# EAGLE design BTModule (EAGLE 9.5.0)
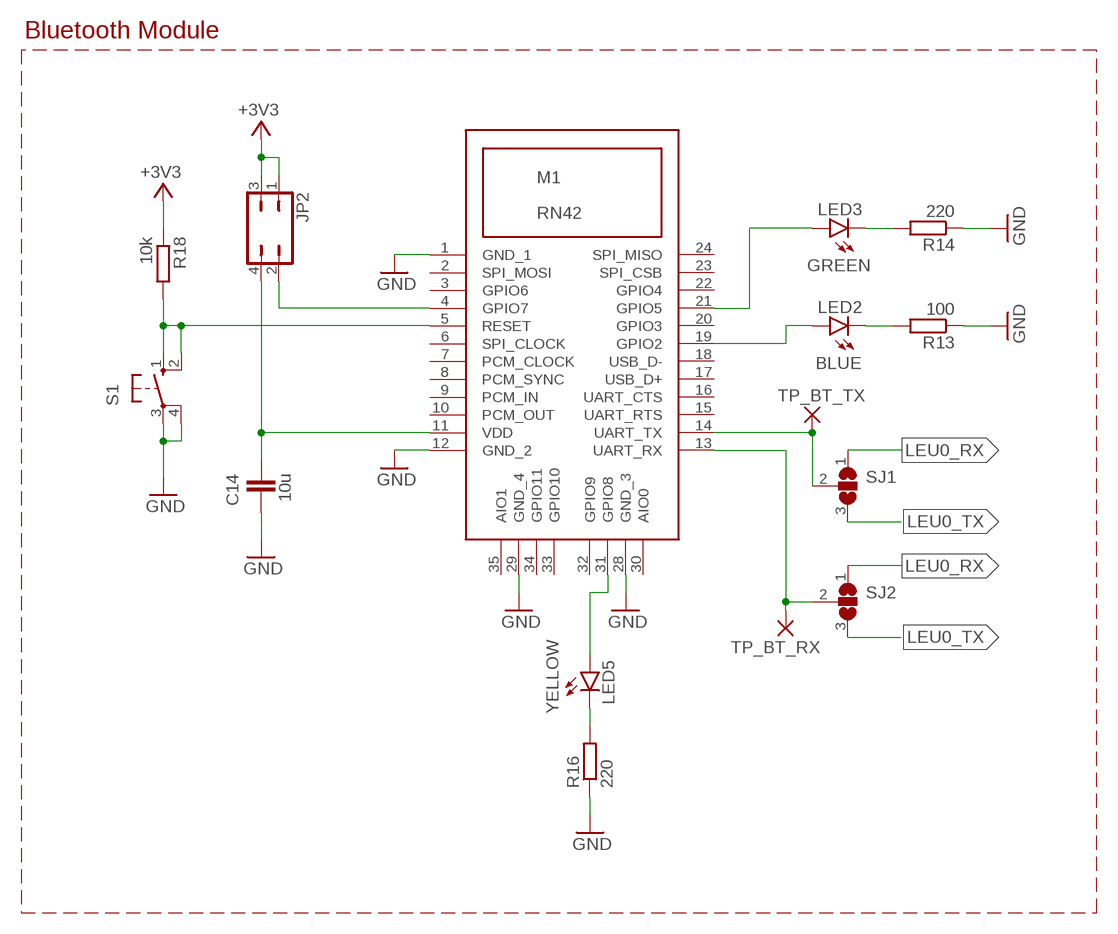
[diagram p0: schematic, sheet 1]

## Parts
C14  10u  C-EUC0805K  [C0805K]
JP2  JP2Q  [JP2Q]
LED2  BLUE  LEDCHIP-LED0805  [CHIP-LED0805]
LED3  GREEN  LEDCHIP-LED0805  [CHIP-LED0805]
LED5  YELLOW  LEDCHIP-LED0805  [CHIP-LED0805]
M1  RN42_BLUETOOTH  [RN42_BLUETOOTH]
R13  100  R-EU_R0805  [R0805]
R14  220  R-EU_R0805  [R0805]
R16  220  R-EU_R0805  [R0805]
R18  10k  R-EU_R0805  [R0805]
S1  10-XX  [B3F-10XX]
SJ1  SJ2W  [SJ_2]
SJ2  SJ2W  [SJ_2]
TP_BT_RX  TESTPOINT  [3,2/1,6]
TP_BT_TX  TESTPOINT  [3,2/1,6]

## Nets
+3V3: JP2.1 JP2.3 R18.1
GND: C14.1 M1.1(GND_1) M1.12(GND_2) M1.28(GND_3) M1.29(GND_4) R13.1 R14.1 R16.1 S1.3(P) S1.4(P1)
LEU0_RX: SJ1.1 SJ2.1
LEU0_TX: SJ1.3 SJ2.3
N$9: JP2.2 M1.4(GPIO7)
N$12: C14.2 JP2.4 M1.11(VDD)
N$15: LED2.C R13.2
N$16: LED2.A M1.19(GPIO2)
N$17: LED3.C R14.2
N$18: LED3.A M1.21(GPIO5)
N$19: LED5.C R16.2
N$20: LED5.A M1.31(GPIO8)
N$21: M1.5(RESET) R18.2 S1.1(S) S1.2(S1)
N$31: M1.14(UART_TX) SJ1.2 TP_BT_TX.1(P)
N$32: M1.13(UART_RX) SJ2.2 TP_BT_RX.1(P)
Unconnected: M1.2(SPI_MOSI) M1.3(GPIO6) M1.6(SPI_CLOCK) M1.7(PCM_CLOCK) M1.8(PCM_SYNC) M1.9(PCM_IN) M1.10(PCM_OUT) M1.15(UART_RTS) M1.16(UART_CTS) M1.17(USB_D+) M1.18(USB_D-) M1.20(GPIO3) M1.22(GPIO4) M1.23(SPI_CSB) M1.24(SPI_MISO) M1.30(AIO0) M1.32(GPIO9) M1.33(GPIO10) M1.34(GPIO11) M1.35(AIO1)

## Notes on the sheet
- Bluetooth Module

## Library data of the parts
C14 = rcl:C-EU: CAPACITOR, European symbol; SPICEPREFIX: C
JP2 = jumper:JP2Q: JUMPER
LED2 LED3 LED5 = led:LED: LED OSRAM: - CHIPLED LG R971, LG N971, LY N971, LG Q971, LY Q971, LO R971, LY R971 LH N974, LH R974 LS Q976, LO Q976, LY Q976 LO Q996 - Hyper CHIPLED LW Q18S LB Q993, LB Q99A, LB R99A - SideLED LS A670, LO A670, LY A670, LG A670, LP A670 LB A673, LV A673, LT A673, LW A673 LH A674 LY A675 LS A676, LA A676, LO A676, LY A676, LW A676 LS A679, LY A679, LG A679 - Hyper Micro SIDELED® LS Y876, LA Y876, LO Y876, LY Y876 LT Y87S - SmartLED LW L88C, LW L88S LB L89C, LB L89S, LG L890 LS L89K, LO L89K, LY L89K LS L896, LA L896, LO L896, LY L896 - TOPLED LS T670, LO T670, LY T670, LG T670, LP T670 LSG T670, LSP T670, LSY T670, LOP T670, LYG T670 LG T671, LOG T671, LSG T671 LB T673, LV T673, LT T673, LW T673 LH T674 LS T676, LA T676, LO T676, LY T676, LB T676, LH T676, LSB T676, LW T676 LB T67C, LV T67C, LT T67C, LS T67K, LO T67K, LY T67K, LW E67C LS E67B, LA E67B, LO E67B, LY E67B, LB E67C, LV E67C, LT E67C LW T67C LS T679, LY T679, LG T679 LS T770, LO T770, LY T770, LG T770, LP T770 LB T773, LV T773, LT T773, LW T773 LH T774 LS E675, LA E675, LY E675, LS T675 LS T776, LA T776, LO T776, LY T776, LB T776 LHGB T686 LT T68C, LB T68C - Hyper Mini TOPLED® LB M676 - Mini TOPLED Santana® LG M470 LS M47K, LO M47K, LY M47K Source: http://www.osram.convergy.de LUXEON: - LUMILED® LXK2-PW12-R00, LXK2-PW12-S00, LXK2-PW14-U00, LXK2-PW14-V00 LXK2-PM12-R00, LXK2-PM12-S00, LXK2-PM14-U00 LXK2-PE12-Q00, LXK2-PE12-R00, LXK2-PE12-S00, LXK2-PE14-T00, LXK2-PE14-U00 LXK2-PB12-K00, LXK2-PB12-L00, LXK2-PB12-M00, LXK2-PB14-N00, LXK2-PB14-P00, LXK2-PB14-Q00 LXK2-PR12-L00, LXK2-PR12-M00, LXK2-PR14-Q00, LXK2-PR14-R00 LXK2-PD12-Q00, LXK2-PD12-R00, LXK2-PD12-S00 LXK2-PH12-R00, LXK2-PH12-S00 LXK2-PL12-P00, LXK2-PL12-Q00, LXK2-PL12-R00 Source: www.luxeon.com KINGBRIGHT: KA-3528ASYC Source: www.kingbright.com; SPICEPREFIX: L
M1 = Moodlight:RN42_BLUETOOTH: RN42 Bluetooth module
R13 R14 R16 R18 = rcl:R-EU_: RESISTOR, European symbol; SPICEPREFIX: R
S1 = switch-omron:10-XX: OMRON SWITCH; MPN: B3F-1000; OC_FARNELL: 176432; OC_NEWARK: 36M3542
SJ1 SJ2 = jumper:SJ2W: SMD solder JUMPER
TP_BT_RX TP_BT_TX = Moodlight:TESTPOINT: Testpoint Drill: 1.6mm (dia) Pad: 3.2mm (dia)

## Board
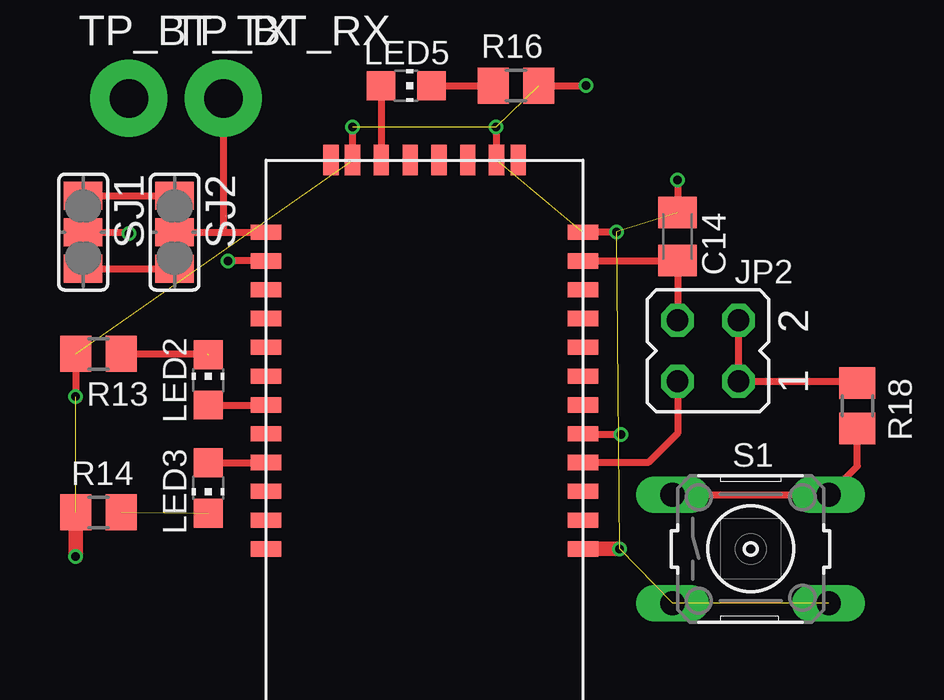
[diagram p1: board, top side]
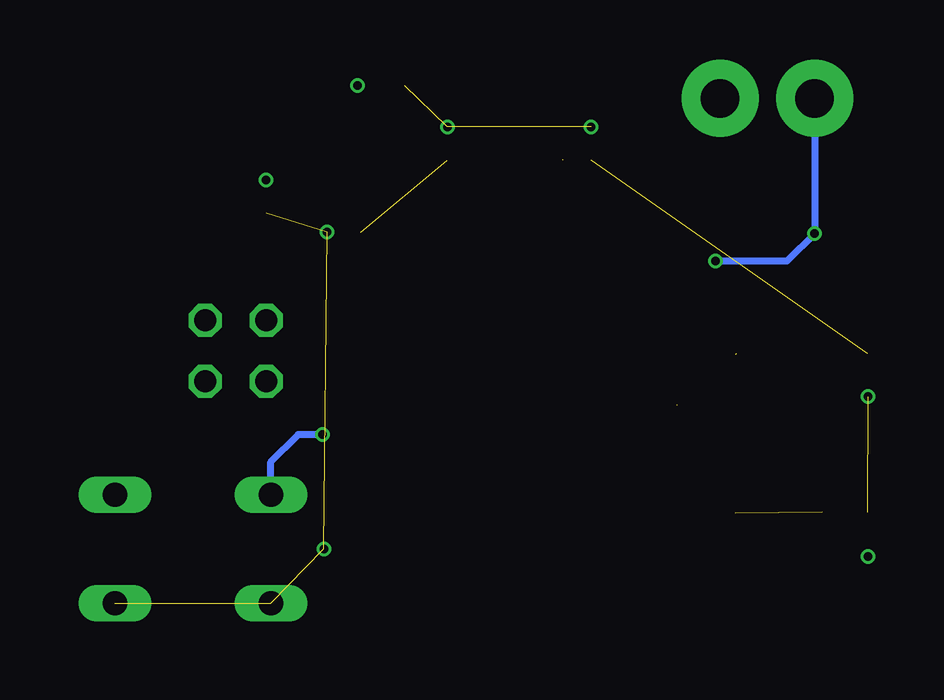
[diagram p2: board, bottom side, seen from below]

No outline drawn. Coordinates in mm, seen from the top.
Copper layers (1*16): Top 0.018mm / dielectric 1.55mm / Bottom 0.018mm
Design rules "default": minimum track width 0.15mm, minimum drill 0.35mm, track to track 0.15mm, track to pad 0.15mm, pad to pad 0.15mm, via to via 0.15mm, smd to smd 0mil, copper to edge 0.25mm, drill to drill 0.35mm, minimum pad ring 0.175mm, minimum via ring 0.125mm, stop-mask expansion 0mil, vias tented up to drill 0.45mm, thermal gap 0.2mm

### Footprints (pad centres in the part's own frame; a part is rotated, then mirrored left to right if it is on the bottom)
C0805K = smd 1.3 x 1.6: 1 -1,0; 2 1,0
JP2Q = drill 0.914 octagon: 1 -1.27,-1.27; 2 -1.27,1.27; 3 1.27,-1.27; 4 1.27,1.27
CHIP-LED0805 = smd 1.2 x 1.2: A 0,-1.05; C 0,1.05
RN42_BLUETOOTH = smd 1.27 x 0.635: 1 -6.6,0; 2 -6.6,-1.2; 3 -6.6,-2.4; 4 -6.6,-3.6; 5 -6.6,-4.8; 6 -6.6,-6; 7 -6.6,-7.2; 8 -6.6,-8.4; 9 -6.6,-9.6; 10 -6.6,-10.8; 11 -6.6,-12; 12 -6.6,-13.2; 13 6.6,-13.2; 14 6.6,-12; 15 6.6,-10.8; 16 6.6,-9.6; 17 6.6,-8.4; 18 6.6,-7.2; 19 6.6,-6; 20 6.6,-4.8; 21 6.6,-3.6; 22 6.6,-2.4; 23 6.6,-1.2; 24 6.6,0 | smd 0.635 x 1.27: 28 3,-16.2; 29 -3,-16.2; 30 3.9,-16.2; 31 1.8,-16.2; 32 0.6,-16.2; 33 -0.6,-16.2; 34 -1.8,-16.2; 35 -3.9,-16.2
R0805 = smd 1.3 x 1.5: 1 -0.95,0; 2 0.95,0
B3F-10XX = drill 1.016 long: 1 -3.251,2.261; 2 3.251,2.261; 3 -3.251,-2.261; 4 3.251,-2.261
SJ_2 = smd 1.168 x 1.6: 1 -1.524,0; 2 0,0; 3 1.524,0
3,2/1,6 = drill 1.6 pad 3.2: 1 0,0

### Placement (x,y rotation side)
C14  26.67,23.05 270 top
JP2  27.94,18.29 90 top
LED2  7.11,17.08 0 top
LED3  7.11,12.57 180 top
LED5  15.37,29.34 270 top
M1  16.13,10.03 180 top
R13  2.54,18.16 0 top
R14  2.54,11.56 0 top
R16  19.94,29.34 180 top
R18  34.16,16 270 top
S1  29.72,10.03 0 top
SJ1  1.91,23.24 270 top
SJ2  5.71,23.24 270 top
TP_BT_RX  7.75,28.81 0 top
TP_BT_TX  3.81,28.81 0 top

### Tracks (layer width: path | path; a pad name or v marks a point on that pad's centre or on a via)
+3V3
  Top 0.3: JP2.3 JP2.1 34.1,17.02 R18.1
GND  (via drill 0.35)  (9 unrouted)
  Top 0.3: R16.1 v22.86,29.34 | M1.28 v13.13,27.62 | R13.1 v1.59,16.39 | v26.67,25.4 C14.1 | M1.12 v24.13,23.24 | M1.29 19.13,27.61 v19.11,27.62
  Top 0.6: v1.59,16.39 v1.59,16.38 | R14.1 v1.59,9.72 | M1.1 v24.26,10.03
LEU0_RX
  Top 0.3: SJ1.1 SJ2.1
LEU0_TX
  Top 0.3: SJ1.3 SJ2.3
N$9
  Top 0.3: JP2.2 26.67,14.86 25.44,13.63 M1.4
N$12
  Top 0.3: JP2.4 C14.2 26.65,22.03 M1.11
N$15  (1 unrouted)
  Top 0.3: R13.2 7.08,18.16
N$16  (1 unrouted)
  Top 0.3: LED2.A M1.19
N$17  (1 unrouted)
N$18
  Top 0.3: LED3.A M1.21
N$19
  Top 0.3: LED5.C R16.2
N$20  (1 unrouted)
  Top 0.3: LED5.A 14.32,26.25
N$21  (via drill 0.35)
  Top 0.3: S1.1 S1.2 34.16,13.49 R18.2 | v24.32,14.8 22.77,14.8 M1.5
  Bottom 0.3: v24.32,14.8 25.34,14.8 26.47,13.66 S1.1
N$31  (via drill 0.35)
  Top 0.3: M1.14 v7.94,22.03 | SJ1.2 3.75,23.24 v3.81,23.18
  Bottom 0.3: v7.94,22.03 4.96,22.03 v3.81,23.18 TP_BT_TX.1
N$32
  Top 0.3: SJ2.2 7.75,23.24 | 7.75,23.24 M1.13 | TP_BT_RX.1 7.75,23.24